# EasyEDA Pro project ProPrj_PCB_PCB_PCB_PCB_STM32F103C8T6(gift)_2023-09-09_2023-10-22_2024-01-15_2025-05-13.epro, board PCB4
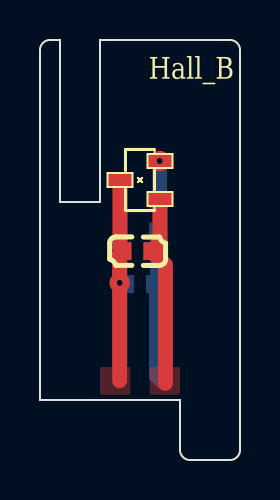
[diagram p8: board, top side]
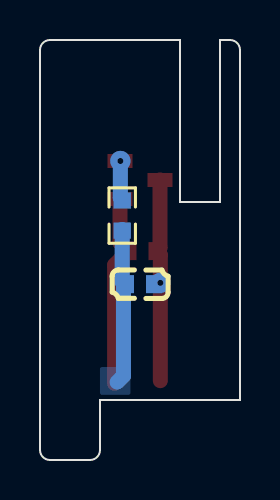
[diagram p9: board, bottom side, seen from below]

Outline 10 x 21 mm; copper layers: Top Layer, Bottom Layer. Coordinates in mm from the lower left corner of the outline.
Outline path: 0,15 0,3 ; 0,3 0,20.5 arc(0.15,20.85) 0.5,21 1,21 1,12.9 3,12.9 3,21 9.5,21 arc(9.85,20.85) 10,20.5 10,0.5 arc(9.85,0.15) 9.5,0 7.5,0 arc(7.15,0.15) 7,0.5 7,3 0,3 ; 0,3 0.75,3
Stack: Top Layer 0.035mm / Dielectric1 1.51mm FR4 er 4.5 / Bottom Layer 0.035mm

## Design rules (mm)
template: JLCPCB Capability(Two Layers Board)
spacing copperThickness1oz (default): track to track 0.102, other pairs 0.152 to 0.3
spacing copperThickness2oz: track to track 0.203, other pairs 0.152 to 0.3
track width copperThickness1oz (default): min 0.127, default 0.254, max 2.54
track width copperThickness2oz: min 0.203, default 0.254, max 2.54
differential pair differentialPair (default): width min 0.127, default 0.254, max 2.54; gap min 0.152, default 0.152
via viaSize (default): diameter min 0.5, default 0.61, max 10; hole min 0.3, default 0.305, max 6.3

## Placement (name value [footprint] x y rotation side)
C1  100nF  [C0603]  4.87 10.44 180 top
C2  100nF  [C0603]  5 8.79 0 bottom
R1  0  [R0603]  5.89 12.22 90 bottom
U1  DRV5055A4QDBZR  [SOT-23-3_L2.9-W1.3-P1.90-LS2.4-BR]  5 14 0 top

## Footprints (pads in the part's own frame, mm; a bottom-side part is the same pattern mirrored in y, then rotated)
C0603
  rect 0.8x0.9 smd: 1(-0.7,0) 2(0.7,0)
R0603
  rect 0.806x0.864 smd: 1(-0.753,0) 2(0.753,0)
SOT-23-3_L2.9-W1.3-P1.90-LS2.4-BR
  rect 1.25x0.7 smd: 1(1,-0.95) 2(1,0.95) 3(-1,0)

## Nets
As in the schematic.

## Via types
v1: diameter 1.016, hole 0.305, Top Layer to Bottom Layer, 2 vias

## Routing (per net, layer and track width the routed paths; a pad name or vN(x,y) marks a point on that pad's centre or on a via; arc(x,y) is an arc through that point)
+5V: length 9.7
  Top Layer w0.75: 6.27,3.84 6.27,9.75 C1.1 6,10.87 U1.1
GND: length 10.2
  Top Layer w0.75: 3.98,3.97 v1(3.98,8.86) 3.98,10.25 C1.2 4,10.62 U1.3
OUT: length 7.8
  Bottom Layer w0.75: 6.14,3.9 5.83,4.21 5.83,8.85 5.89,8.91 5.89,11.52
$1N190: length 2
  Bottom Layer w0.75: v1(5.98,14.95) 5.98,13.12 5.89,13.03

## Copper pours and planes (outline as drawn; the poured copper is in the pictures)
+5V on Top Layer: 5.48,4.65 7,4.65 7,3.13 5.48,3.13
GND on Top Layer: 3,4.65 4.52,4.65 4.52,3.13 3,3.13
OUT on Bottom Layer: 5.48,4.65 7,4.65 7,3.13 5.48,3.13

## Text on the board
Top Silkscreen Layer: Hall_B
